# EAGLE board rt1060r2 (EAGLE 9.6.2)
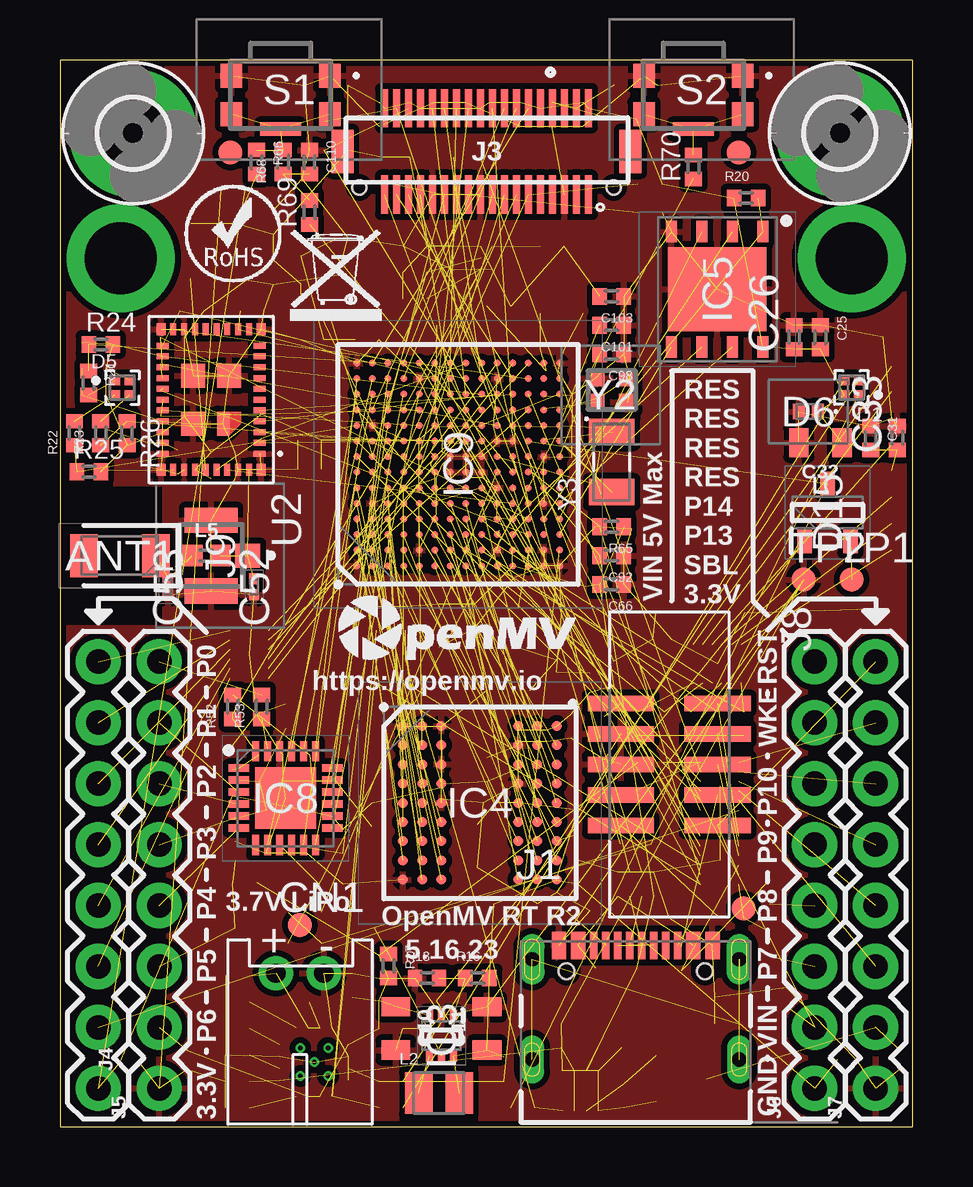
[diagram p15: board, top side]
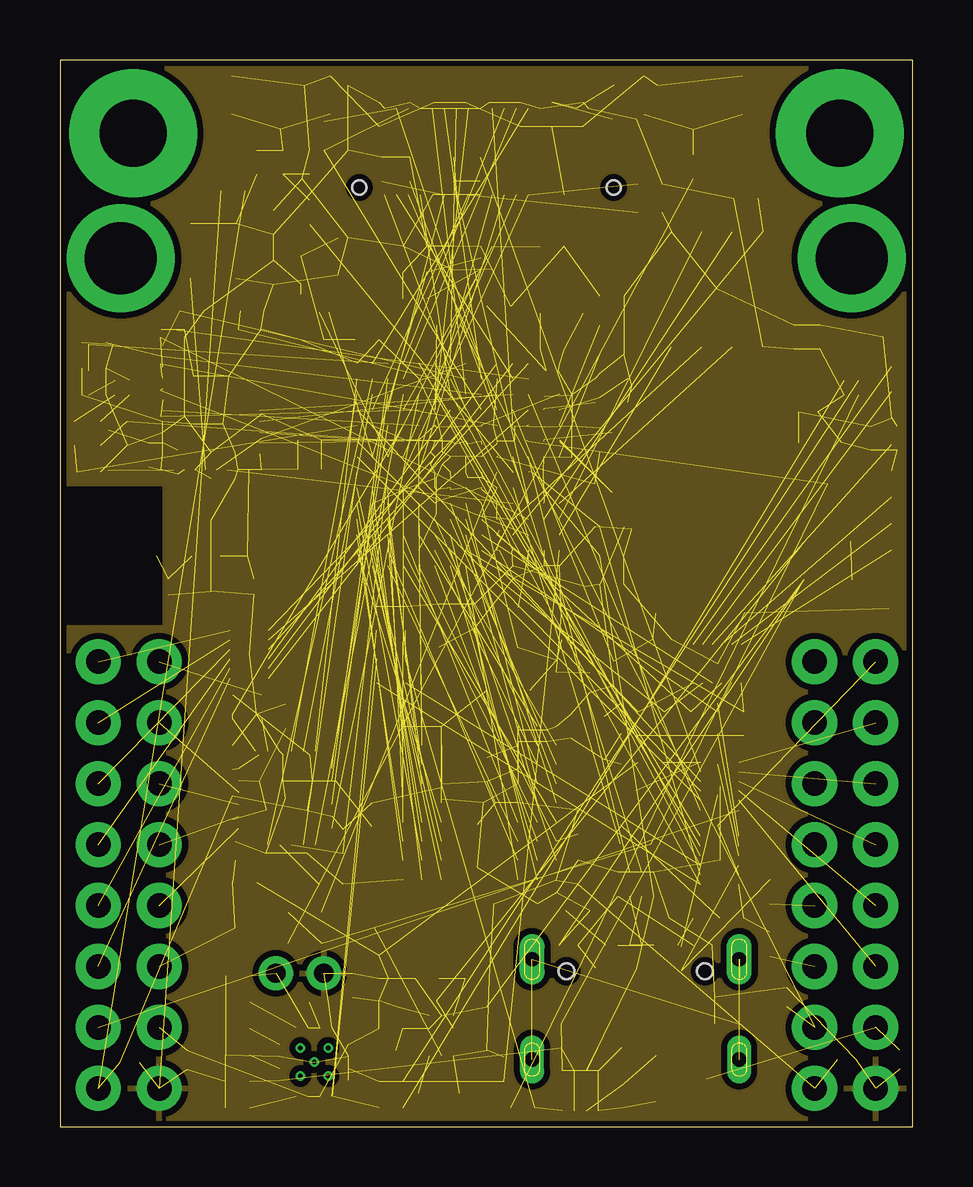
[diagram p16: board, inner layer GND]
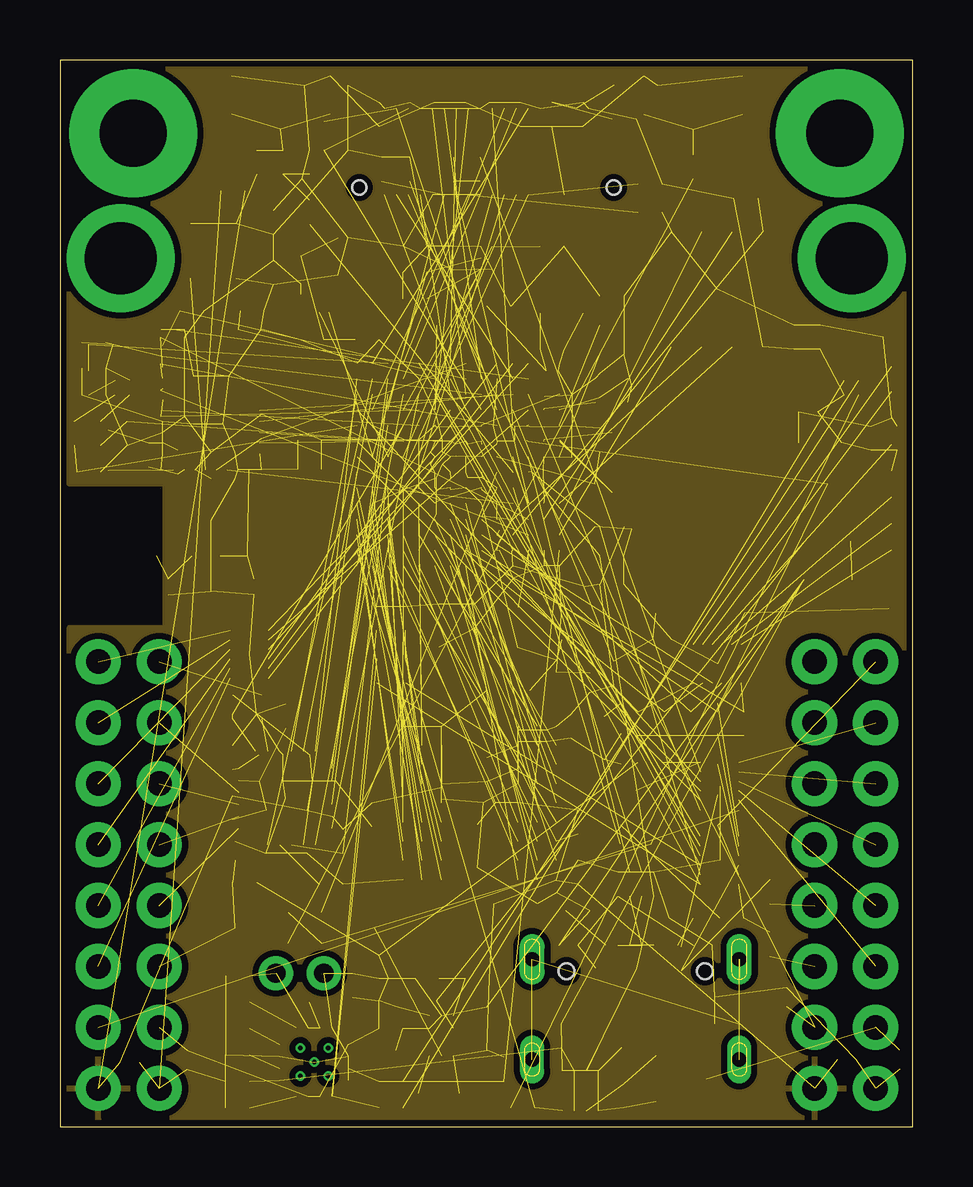
[diagram p17: board, inner layer VCC]
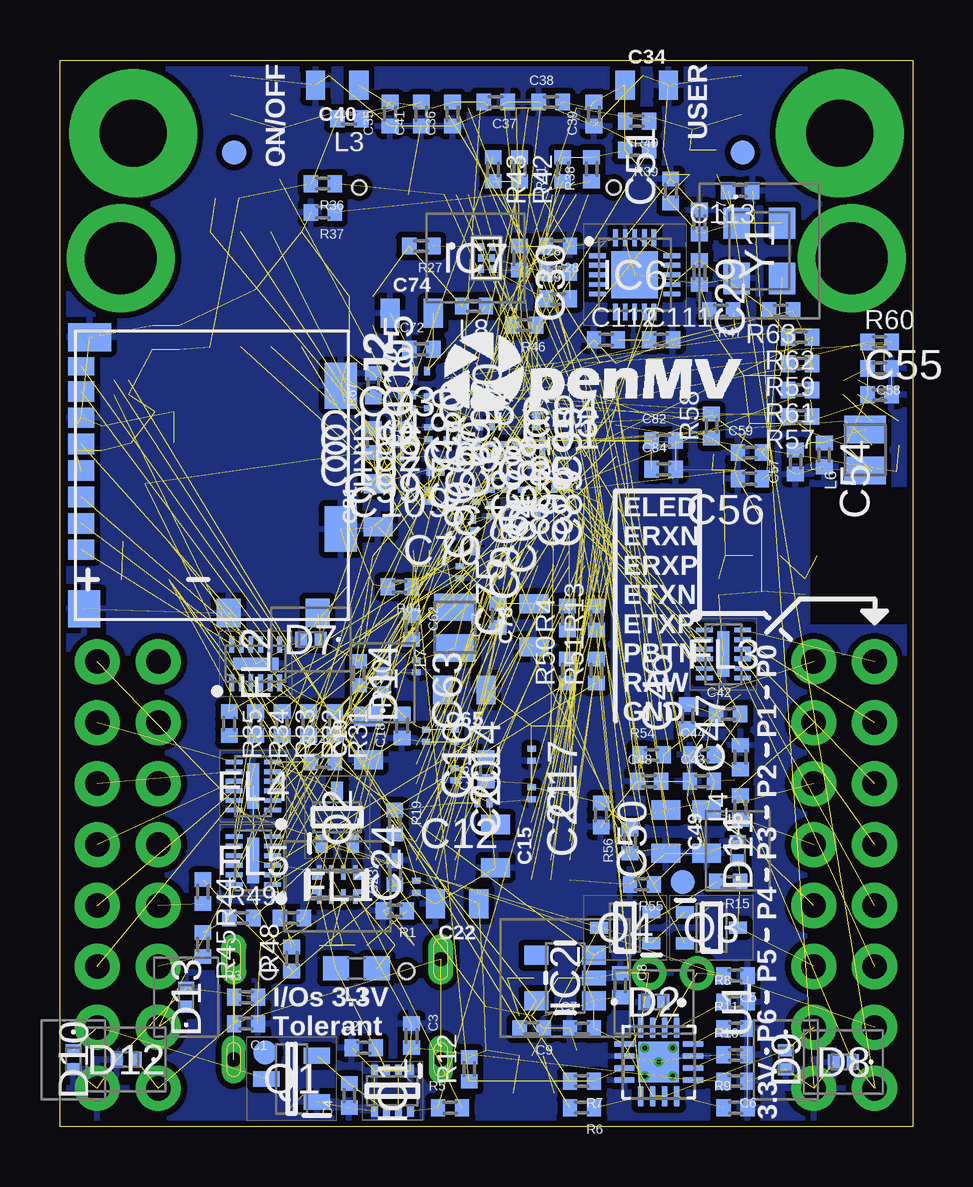
[diagram p18: board, bottom side, seen from below]

Size 35.56 x 44.45 mm. Coordinates in mm from the lower left corner, seen from the top.
Outline: 0,44.45 0,0 35.56,0 35.56,44.45 0,44.45
Copper layers (1*2*3*4*13*14*15*16): Top 0.035mm / dielectric 0.15mm / GND 0.035mm / dielectric 0.25mm / Route3 0.035mm / dielectric 0.15mm / Route4 0.035mm / dielectric 0.25mm / Route13 0.035mm / dielectric 0.15mm / Route14 0.035mm / dielectric 0.25mm / VCC 0.035mm / dielectric 0.15mm / Bottom 0.035mm
Design rules "MF_Ext_4_mil_drill_8_Layer *": minimum track width 3mil, minimum drill 4mil, track to track 3mil, track to pad 3mil, pad to pad 3mil, via to via 3mil, smd to smd 0mil, copper to edge 3mil, drill to drill 3mil, minimum pad ring 3mil, minimum via ring 3mil, stop-mask expansion 2mil, vias tented up to drill 25mil, thermal gap 10mil
Net classes: 0 default: width 0.102 mm, drill 0.127 mm, clearance 0.102 mm; 1 power: width 0.254 mm, drill 0.254 mm, clearance 0.102 mm; 2 gnd: width 0.102 mm, drill 0.127 mm, clearance 0.102 mm; 3 sdram: width 0.102 mm, drill 0.127 mm, clearance 0.102 mm; 4 jtag: width 0.102 mm, drill 0.127 mm, clearance 0.102 mm; 5 dcmi: width 0.102 mm, drill 0.127 mm, clearance 0.102 mm; 6 spi: width 0.102 mm, drill 0.127 mm, clearance 0.102 mm; 7 flash: width 0.102 mm, drill 0.127 mm, clearance 0.102 mm; 9 eth: width 0.102 mm, drill 0.127 mm, clearance 0.102 mm; 10 mdi: width 0.127 mm, drill 0.127 mm, clearance 0.102 mm; 11 wifi: width 0.102 mm, drill 0.127 mm, clearance 0.102 mm; 12 sdcard: width 0.102 mm, drill 0.127 mm, clearance 0.102 mm; 13 i2c: width 0.102 mm, drill 0.127 mm, clearance 0.102 mm; 14 mdio: width 0.102 mm, drill 0.127 mm, clearance 0.102 mm; 15 usb: width 0.102 mm, drill 0.127 mm, clearance 0.102 mm

## Footprints (pad centres in the part's own frame; a part is rotated, then mirrored left to right if it is on the bottom)
ANTC3216X140N = smd 1.15 x 1.8: 1 -1.5,0; 2 1.5,0
0402 = smd 0.6 x 0.7: 1 -0.5,0; 2 0.5,0
0805 = smd 0.8 x 1.2: 1 -0.9,0; 2 0.9,0
C0201 = smd 0.25 x 0.35: 1 -0.25,0; 2 0.25,0
CAPC0603X33N = smd 0.46 x 0.42: 1 -0.33,0; 2 0.33,0
JST-PH-2-THM-RA = drill 0.8 pad 1.422: 1 1,0; 2 -1,0
LED_UHD1110-FKA-CL1A13R3Q1BBQFMF3 = smd 0.4 x 0.4: 1 -0.3,0.3; 2 -0.3,-0.3; 3 0.3,-0.3; 4 0.3,0.3
CPDQT5V0HEHF = smd 0.5 x 0.65: 1 -0.4,0; 2 0.4,0
SOT96P237X111-3N = smd 1 x 0.6: 1 -1.2,0.955; 2 -1.2,-0.955; 3 1.2,0
FIDUCIAL-1X2 = smd 1 x 1: 1 0,0
ECMF024CMX8 = smd 0.2 x 0.6: 1 -0.75,-0.5; 2 -0.25,-0.5; 3 0.25,-0.5; 4 0.75,-0.5; 5 0.75,0.5; 6 0.25,0.5; 7 -0.25,0.5; 8 -0.75,0.5 | smd 0.2 x 0.2: 9 -0.95,0.3; 10 -0.95,-0.3; 11 0.95,-0.3; 12 0.95,0.3
SON40P150X250X65-13N = smd 0.7 x 0.2: 1 -0.8,1; 2 -0.8,0.6; 3 -0.8,0.2; 4 -0.8,-0.2; 5 -0.8,-0.6; 6 -0.8,-1; 7 0.8,-1; 8 0.8,-0.6; 9 0.8,-0.2; 10 0.8,0.2; 11 0.8,0.6; 12 0.8,1 | smd 0.5 x 1.9: 13 0,0
2,8-PAD = drill 2.8 pad 5.334: B2,8 0,0
SOTFL50P160X60-8N = smd 0.475 x 0.3: 1 -0.838,0.75; 2 -0.838,0.25; 3 -0.838,-0.25; 4 -0.838,-0.75; 5 0.838,-0.75; 6 0.838,-0.25; 7 0.838,0.25; 8 0.838,0.75
TCR2LF33LMCT = smd 0.8 x 1: 1 -0.95,-1.2; 3 0.95,-1.2; 4 0.95,1.2; 5 -0.95,1.2 | smd 0.6 x 1: 2 0,-1.2
SOTFL50P162X60-6N = smd 0.492 x 0.3: 1 -0.834,0.5; 2 -0.834,0; 3 -0.834,-0.5; 4 0.834,-0.5; 5 0.834,0; 6 0.834,0.5
BGA54C80P9X9_800X800X120 = smd 0.41 x 0.41: A1 -3.2,3.2; A2 -2.4,3.2; A3 -1.6,3.2; A7 1.6,3.2; A8 2.4,3.2; A9 3.2,3.2; B1 -3.2,2.4; B2 -2.4,2.4; B3 -1.6,2.4; B7 1.6,2.4; B8 2.4,2.4; B9 3.2,2.4; C1 -3.2,1.6; C2 -2.4,1.6; C3 -1.6,1.6; C7 1.6,1.6; C8 2.4,1.6; C9 3.2,1.6; D1 -3.2,0.8; D2 -2.4,0.8; D3 -1.6,0.8; D7 1.6,0.8; D8 2.4,0.8; D9 3.2,0.8; E1 -3.2,0; E2 -2.4,0; E3 -1.6,0; E7 1.6,0; E8 2.4,0; E9 3.2,0; F1 -3.2,-0.8; F2 -2.4,-0.8; F3 -1.6,-0.8; F7 1.6,-0.8; F8 2.4,-0.8; F9 3.2,-0.8; G1 -3.2,-1.6; G2 -2.4,-1.6; G3 -1.6,-1.6; G7 1.6,-1.6; G8 2.4,-1.6; G9 3.2,-1.6; H1 -3.2,-2.4; H2 -2.4,-2.4; H3 -1.6,-2.4; H7 1.6,-2.4; H8 2.4,-2.4; H9 3.2,-2.4; J1 -3.2,-3.2; J2 -2.4,-3.2; J3 -1.6,-3.2; J7 1.6,-3.2; J8 2.4,-3.2; J9 3.2,-3.2
SON127P500X595X80-9N = smd 0.9 x 0.45: 1 -2.4,1.905; 2 -2.4,0.635; 3 -2.4,-0.635; 4 -2.4,-1.905; 5 2.4,-1.905; 6 2.4,-0.635; 7 2.4,0.635; 8 2.4,1.905 | smd 3.5 x 4.1: 9 0,0
QFN40P300X300X33-21N = smd 0.7 x 0.2: 1 -1.55,0.8; 2 -1.55,0.4; 3 -1.55,0; 4 -1.55,-0.4; 5 -1.55,-0.8; 11 1.55,-0.8; 12 1.55,-0.4; 13 1.55,0; 14 1.55,0.4; 15 1.55,0.8 | smd 0.2 x 0.7: 6 -0.8,-1.55; 7 -0.4,-1.55; 8 0,-1.55; 9 0.4,-1.55; 10 0.8,-1.55; 16 0.8,1.55; 17 0.4,1.55; 18 0,1.55; 19 -0.4,1.55; 20 -0.8,1.55 | smd 1.95 x 1.95: 21 0,0
MXC4005XC = smd 0.25 x 0.3: 1 -0.22,0.46; 2 -0.22,0; 3 -0.22,-0.46; 4 0.22,-0.46; 5 0.22,0; 6 0.22,0.46
QFN50P400X400X90-25N = smd 0.85 x 0.3: 1 -1.95,1.25; 2 -1.95,0.75; 3 -1.95,0.25; 4 -1.95,-0.25; 5 -1.95,-0.75; 6 -1.95,-1.25; 13 1.95,-1.25; 14 1.95,-0.75; 15 1.95,-0.25; 16 1.95,0.25; 17 1.95,0.75; 18 1.95,1.25 | smd 0.3 x 0.85: 7 -1.25,-1.95; 8 -0.75,-1.95; 9 -0.25,-1.95; 10 0.25,-1.95; 11 0.75,-1.95; 12 1.25,-1.95; 19 1.25,1.95; 20 0.75,1.95; 21 0.25,1.95; 22 -0.25,1.95; 23 -0.75,1.95; 24 -1.25,1.95 | smd 2.55 x 2.55: 25 0,0
BGA196C65P14X14_1000X1000X143 = smd 0.29 x 0.29: A1 -4.225,4.225; A2 -3.575,4.225; A3 -2.925,4.225; A4 -2.275,4.225; A5 -1.625,4.225; A6 -0.975,4.225; A7 -0.325,4.225; A8 0.325,4.225; A9 0.975,4.225; A10 1.625,4.225; A11 2.275,4.225; A12 2.925,4.225; A13 3.575,4.225; A14 4.225,4.225; B1 -4.225,3.575; B2 -3.575,3.575; B3 -2.925,3.575; B4 -2.275,3.575; B5 -1.625,3.575; B6 -0.975,3.575; B7 -0.325,3.575; B8 0.325,3.575; B9 0.975,3.575; B10 1.625,3.575; B11 2.275,3.575; B12 2.925,3.575; B13 3.575,3.575; B14 4.225,3.575; C1 -4.225,2.925; C2 -3.575,2.925; C3 -2.925,2.925; C4 -2.275,2.925; C5 -1.625,2.925; C6 -0.975,2.925; C7 -0.325,2.925; C8 0.325,2.925; C9 0.975,2.925; C10 1.625,2.925; C11 2.275,2.925; C12 2.925,2.925; C13 3.575,2.925; C14 4.225,2.925; D1 -4.225,2.275; D2 -3.575,2.275; D3 -2.925,2.275; D4 -2.275,2.275; D5 -1.625,2.275; D6 -0.975,2.275; D7 -0.325,2.275; D8 0.325,2.275; D9 0.975,2.275; D10 1.625,2.275; D11 2.275,2.275; D12 2.925,2.275; D13 3.575,2.275; D14 4.225,2.275; E1 -4.225,1.625; E2 -3.575,1.625; E3 -2.925,1.625; E4 -2.275,1.625; E5 -1.625,1.625; E6 -0.975,1.625; E7 -0.325,1.625; E8 0.325,1.625; E9 0.975,1.625; E10 1.625,1.625; E11 2.275,1.625; E12 2.925,1.625; E13 3.575,1.625; E14 4.225,1.625; F1 -4.225,0.975; F2 -3.575,0.975; F3 -2.925,0.975; F4 -2.275,0.975; F5 -1.625,0.975; F6 -0.975,0.975; F7 -0.325,0.975; F8 0.325,0.975; F9 0.975,0.975; F10 1.625,0.975; F11 2.275,0.975; F12 2.925,0.975; F13 3.575,0.975; F14 4.225,0.975; G1 -4.225,0.325; G2 -3.575,0.325; G3 -2.925,0.325; G4 -2.275,0.325; G5 -1.625,0.325; G6 -0.975,0.325; G7 -0.325,0.325; G8 0.325,0.325; G9 0.975,0.325; G10 1.625,0.325; G11 2.275,0.325; G12 2.925,0.325; G13 3.575,0.325; G14 4.225,0.325; H1 -4.225,-0.325; H2 -3.575,-0.325; H3 -2.925,-0.325; H4 -2.275,-0.325; H5 -1.625,-0.325; H6 -0.975,-0.325; H7 -0.325,-0.325; H8 0.325,-0.325; H9 0.975,-0.325; H10 1.625,-0.325; H11 2.275,-0.325; H12 2.925,-0.325; H13 3.575,-0.325; H14 4.225,-0.325; J1 -4.225,-0.975; J2 -3.575,-0.975; J3 -2.925,-0.975; J4 -2.275,-0.975; J5 -1.625,-0.975; J6 -0.975,-0.975; J7 -0.325,-0.975; J8 0.325,-0.975; J9 0.975,-0.975; J10 1.625,-0.975; J11 2.275,-0.975; J12 2.925,-0.975; J13 3.575,-0.975; J14 4.225,-0.975; K1 -4.225,-1.625; K2 -3.575,-1.625; K3 -2.925,-1.625; K4 -2.275,-1.625; K5 -1.625,-1.625; K6 -0.975,-1.625; K7 -0.325,-1.625; K8 0.325,-1.625; K9 0.975,-1.625; K10 1.625,-1.625; K11 2.275,-1.625; K12 2.925,-1.625; K13 3.575,-1.625; K14 4.225,-1.625; L1 -4.225,-2.275; L2 -3.575,-2.275; L3 -2.925,-2.275; L4 -2.275,-2.275; L5 -1.625,-2.275; L6 -0.975,-2.275; L7 -0.325,-2.275; L8 0.325,-2.275; L9 0.975,-2.275; L10 1.625,-2.275; L11 2.275,-2.275; L12 2.925,-2.275; L13 3.575,-2.275; L14 4.225,-2.275; M1 -4.225,-2.925; M2 -3.575,-2.925; M3 -2.925,-2.925; M4 -2.275,-2.925; M5 -1.625,-2.925; M6 -0.975,-2.925; M7 -0.325,-2.925; M8 0.325,-2.925; M9 0.975,-2.925; M10 1.625,-2.925; M11 2.275,-2.925; M12 2.925,-2.925; M13 3.575,-2.925; M14 4.225,-2.925; N1 -4.225,-3.575; N2 -3.575,-3.575; N3 -2.925,-3.575; N4 -2.275,-3.575; N5 -1.625,-3.575; N6 -0.975,-3.575; N7 -0.325,-3.575; N8 0.325,-3.575; N9 0.975,-3.575; N10 1.625,-3.575; N11 2.275,-3.575; N12 2.925,-3.575; N13 3.575,-3.575; N14 4.225,-3.575; P1 -4.225,-4.225; P2 -3.575,-4.225; P3 -2.925,-4.225; P4 -2.275,-4.225; P5 -1.625,-4.225; P6 -0.975,-4.225; P7 -0.325,-4.225; P8 0.325,-4.225; P9 0.975,-4.225; P10 1.625,-4.225; P11 2.275,-4.225; P12 2.925,-4.225; P13 3.575,-4.225; P14 4.225,-4.225
GCT_USB4105-GF-A = smd 0.6 x 1.15: A1_B12 -3.2,4.755; A4_B9 -2.4,4.755; B1_A12 3.2,4.755; B4_A9 2.4,4.755 | smd 0.3 x 1.15: A5 -1.25,4.755; A6 -0.25,4.755; A7 0.25,4.755; A8 1.25,4.755; B5 1.75,4.755; B6 0.75,4.755; B7 -0.75,4.755; B8 -1.75,4.755 | drill 0.6 pad 1.05 long: S1 -4.32,4.18; S4 4.32,4.18 | drill 0.6 pad 1 long: S2 -4.32,0; S3 4.32,0 | hole 0.65: 2.89,3.68; -2.89,3.68
1040310811 = smd 1.2 x 1: CD$1 11.74,10.1; CD$2 11.74,6.4 | smd 1.55 x 1.35: G$1 11.565,0.375 | smd 1.17 x 1.8: G$2 0.245,0.6 | smd 1.9 x 1.35: G$3 2.27,11.075; G$4 8.24,11.075 | smd 0.85 x 1.1: P$1 9.105,0.25; P$2 8.005,0.25; P$3 6.905,0.25; P$4 5.805,0.25; P$5 4.705,0.25; P$6 3.605,0.25; P$7 2.505,0.25 | smd 0.75 x 1.1: P$8 1.455,0.25
DF12-36-DS = smd 0.3 x 1.6: 1 4.25,-1.8; 2 4.25,1.8; 3 3.75,-1.8; 4 3.75,1.8; 5 3.25,-1.8; 6 3.25,1.8; 7 2.75,-1.8; 8 2.75,1.8; 9 2.25,-1.8; 10 2.25,1.8; 11 1.75,-1.8; 12 1.75,1.8; 13 1.25,-1.8; 14 1.25,1.8; 15 0.75,-1.8; 16 0.75,1.8; 17 0.25,-1.8; 18 0.25,1.8; 19 -0.25,-1.8; 20 -0.25,1.8; 21 -0.75,-1.8; 22 -0.75,1.8; 23 -1.25,-1.8; 24 -1.25,1.8; 25 -1.75,-1.8; 26 -1.75,1.8; 27 -2.25,-1.8; 28 -2.25,1.8; 29 -2.75,-1.8; 30 -2.75,1.8; 31 -3.25,-1.8; 32 -3.25,1.8; 33 -3.75,-1.8; 34 -3.75,1.8; 35 -4.25,-1.8; 36 -4.25,1.8 | smd 0.9 x 1.8: F1 6,0; F2 -6,0 | hole 0.6: 5.3,-1.5; -5.3,-1.5
1X08 = drill 1.016 pad 1.88: 1 0,0; 2 2.54,0; 3 5.08,0; 4 7.62,0; 5 10.16,0; 6 12.7,0; 7 15.24,0; 8 17.78,0
CNC_3221-10-0300-00 = smd 0.65 x 2.76: 1 -2.54,-2.02; 2 -2.54,2.02; 3 -1.27,-2.02; 4 -1.27,2.02; 5 0,-2.02; 6 0,2.02; 7 1.27,-2.02; 8 1.27,2.02; 9 2.54,-2.02; 10 2.54,2.02
23370191 = smd 1 x 1.05: 1 0,-1.525 | smd 1.05 x 2.2: 2 -1.475,0; 3 1.475,0
0603 = smd 1.1 x 1: 1 -0.85,0; 2 0.85,0
INDC2016X100N = smd 1.14 x 1.73: 1 -0.847,0; 2 0.847,0
0402' = smd 0.85 x 0.9: 1 -0.58,0; 2 0.58,0
9774030151R = drill 3 pad 4.5: P$1 0,0
SOT96P240X110-3N = smd 1.1 x 0.65: 1 -1.05,0.96; 2 -1.05,-0.96; 3 1.05,0
SOT65P210X110-3N = smd 0.75 x 0.5: 1 -1.1,0.65; 2 -1.1,-0.65; 3 1.1,0
KMS231GLFS = smd 0.9 x 1: 1 -2.05,-0.8; 2 -2.05,0.8; 4 2.05,0.8; 5 2.05,-0.8 | smd 1.7 x 0.55: 3 0,1.425
TP10R = smd 1 x 1: TP 0,0
QFN50P300X300X100-17N = smd 0.86 x 0.26: 1 -1.435,0.75; 2 -1.435,0.25; 3 -1.435,-0.25; 4 -1.435,-0.75; 9 1.435,-0.75; 10 1.435,-0.25; 11 1.435,0.25; 12 1.435,0.75 | smd 0.26 x 0.86: 5 -0.75,-1.435; 6 -0.25,-1.435; 7 0.25,-1.435; 8 0.75,-1.435; 13 0.75,1.435; 14 0.25,1.435; 15 -0.25,1.435; 16 -0.75,1.435 | smd 1.68 x 1.68: 17 0,0 | drill 0.2 pad 0.4: 18 0,0; 19 -0.58,0.58; 20 0.58,0.58; 21 -0.58,-0.58; 22 0.58,-0.58
XCVR_LBEE5KL1DX-TEMP = smd 0.5 x 0.25: 1 -2.025,2.25; 2 -2.025,1.8; 3 -2.025,1.35; 4 -2.025,0.9; 5 -2.025,0.45; 6 -2.025,0; 7 -2.025,-0.45; 8 -2.025,-0.9; 9 -2.025,-1.35; 10 -2.025,-1.8; 11 -2.025,-2.25; 22 2.025,-2.25; 23 2.025,-1.8; 24 2.025,-1.35; 25 2.025,-0.9; 26 2.025,-0.45; 27 2.025,0; 28 2.025,0.45; 29 2.025,0.9; 30 2.025,1.35; 31 2.025,1.8; 32 2.025,2.25 | smd 0.375 x 0.5: 12 -2.087,-2.925; 21 2.087,-2.925; 33 2.087,2.925; 42 -2.087,2.925 | smd 0.25 x 0.5: 13 -1.575,-2.925; 14 -1.125,-2.925; 15 -0.675,-2.925; 16 -0.225,-2.925; 17 0.225,-2.925; 18 0.675,-2.925; 19 1.125,-2.925; 20 1.575,-2.925; 34 1.575,2.925; 35 1.125,2.925; 36 0.675,2.925; 37 0.225,2.925; 38 -0.225,2.925; 39 -0.675,2.925; 40 -1.125,2.925; 41 -1.575,2.925 | smd 0.5 x 1: 43 -0.5,1 | smd 1 x 1: 44 -0.75,-1; 45 0.75,1; 46 0.75,-1
ECS327MVATX3CNTR3 = smd 1.3 x 1.1: 1 -1.15,-0.95; 2 1.15,-0.95; 3 1.15,0.95; 4 -1.15,0.95
XRCGB24M000F3M00R0 = smd 0.75 x 0.7: 1 -0.675,-0.5; 2 0.675,-0.5; 3 0.675,0.5; 4 -0.675,0.5
XTAL_ABS07-32.768KHZ-7-T = smd 1.1 x 1.9: 1 -1.25,0; 2 1.25,0

## Placement (x,y rotation side)
ANT1  AMCA31-2R450G-S1F-T3  [ANTC3216X140N]  2.5,23.8 180 top
C1  1nF  [0402]  27.8,4.3 180 bottom
C2  4.7uF  [0402]  22.9,3.3 0 bottom
C3  4.7uF  [0402]  20.9,3.8 270 bottom
C4  4.7uF  [0402]  23.5,1.3 90 bottom
C5  4.7uF  [0402]  7.4,6.3 180 bottom
C6  4.7uF  [0402]  7.4,1.9 180 bottom
C7  4.7uF  [0402]  13.8,4.1 0 bottom
C8  4.7uF  [0402]  12.2,5.9 270 bottom
C9  4.7uF  [0402]  15.9,4.1 180 bottom
C10  22uF  [0805]  14,4.1 270 top
C11  22uF  [0805]  17.8,4.1 90 top
C12  0.22uF  [C0201]  17.9,13.5 180 bottom
C13  4.7uF  [0402]  17.8,14.9 90 bottom
C14  0.22uF  [C0201]  19.1,16.3 270 bottom
C15  22uF  [0805]  17.4,11.7 270 bottom
C16  0.22uF  [C0201]  20.3,16.3 270 bottom
C17  0.22uF  [C0201]  15.9,15.5 270 bottom
C18  4.7uF  [0402]  21.3,16.7 90 bottom
C19  22uF  [0805]  22.7,16.2 90 bottom
C20  0.22uF  [C0201]  19.1,14.7 270 bottom
C21  0.22uF  [C0201]  15.9,13.9 270 bottom
C22  22uF  [0805]  19,9.3 180 bottom
C23  4.7uF  [0402]  21.6,10.6 90 bottom
C24  0.22uF  [C0201]  20.7,10 90 bottom
C25  4.7uF  [0402]  31.7,32.9 270 top
C26  0.1uF  [0402]  30.6,32.9 90 top
C27  4.7uF  [0402]  8.9,37.7 270 bottom
C28  4.7uF  [0402]  14.8,36.7 180 bottom
C29  0.1uF  [0402]  8.9,35.6 270 bottom
C30  0.1uF  [0402]  16.4,36.2 270 bottom
C31  4.7uF  [0402]  33.8,28.7 270 top
C32  22uF  [0805]  31.7,28.5 180 top
C33  0.1uF  [0402]  34.9,28.7 90 top
C34  22uF  [0805]  11.1,43.4 0 bottom
C35  4.7uF  [0402]  21.8,42.2 90 bottom
C36  4.7uF  [0402]  19.2,42.2 90 bottom
C37  4.7uF  [0402]  17.4,42.7 180 bottom
C38  4.7uF  [0402]  15.1,42.7 0 bottom
C39  4.7uF  [0402]  13.3,42.2 90 bottom
C40  22uF  [0805]  24,43.4 180 bottom
C41  4.7uF  [0402]  20.5,42.2 90 bottom
C42  4.7uF  [0402]  7.7,17.2 0 bottom
C43  4.7uF  [0402]  8.8,14.4 0 bottom
C44  4.7uF  [0402]  8.8,15.5 0 bottom
C45  22uF  [0805]  8.6,12.3 270 bottom
C46  0.1uF  [0402]  9.4,17.1 90 bottom
C47  0.1uF  [0402]  7.2,15.4 90 bottom
C48  4.7uF  [0402]  11,14.4 0 bottom
C49  22uF  [0805]  10.3,12.3 270 bottom
C50  0.1uF  [0402]  13,13 270 bottom
C51  0.1uF  [0402]  10.1,39 90 bottom
C52  GRM0335C1H1R5BA01D  [CAPC0603X33N]  8.1,22.5 270 top
C53  DNP  [CAPC0603X33N]  4.5,22.5 270 top
C54  0.1uF  [0402]  3.7,28 270 bottom
C55  0.1uF  [0402]  1.4,30.5 0 bottom
C56  0.1uF  [0402]  6.8,27 180 bottom
C57  4.7uF  [0402]  4.9,27.7 90 bottom
C58  4.7uF  [0402]  1.4,31.6 180 bottom
C59  4.7uF  [0402]  6.8,28.1 0 bottom
C60  0.22uF  [C0201]  17,26.8 90 bottom
C61  0.22uF  [C0201]  17,28.2 270 bottom
C62  4.7uF  [0402]  20.9,20.8 270 bottom
C63  0.22uF  [C0201]  20.7,19.2 270 bottom
C64  0.22uF  [C0201]  17.6,25.7 270 bottom
C65  22uF  [0805]  18.7,18.2 180 bottom
C66  4.7uF  [0402]  23,22.6 180 top
C67  0.22uF  [C0201]  17.6,26.8 90 bottom
C68  0.22uF  [C0201]  17.6,28.2 270 bottom
C69  0.22uF  [C0201]  17.8,29.2 180 bottom
C70  0.22uF  [C0201]  18.6,25.3 180 bottom
C71  0.22uF  [C0201]  18.2,26.3 90 bottom
C72  4.7uF  [0402]  20.5,32.4 0 bottom
C73  0.22uF  [C0201]  20.5,31.5 180 bottom
C74  22uF  [0805]  20.9,33.9 0 bottom
C75  0.22uF  [C0201]  18.9,23.1 270 bottom
C76  0.22uF  [C0201]  18.6,24 0 bottom
C77  4.7uF  [0402]  17.3,21.3 90 bottom
C78  22uF  [0805]  15.8,20.9 90 bottom
C79  4.7uF  [0402]  22.5,28.6 270 bottom
C80  0.22uF  [C0201]  18.2,28.2 90 bottom
C81  22uF  [0805]  22.3,25.9 90 bottom
C82  4.7uF  [0402]  10.4,28.6 0 bottom
C83  0.22uF  [C0201]  14.7,26.6 180 bottom
C84  4.7uF  [0402]  10.4,27.4 0 bottom
C85  0.22uF  [C0201]  14.7,28.6 180 bottom
C86  0.22uF  [C0201]  19.2,28.6 0 bottom
C87  0.22uF  [C0201]  19.2,29.2 0 bottom
C88  0.22uF  [C0201]  15.7,25.8 90 bottom
C89  0.22uF  [C0201]  15.7,26.8 270 bottom
C90  0.22uF  [C0201]  20.2,26.3 270 bottom
C91  0.22uF  [C0201]  15.7,27.6 0 bottom
C92  4.7uF  [0402]  23,23.8 180 top
C93  0.22uF  [C0201]  15.7,28.1 0 bottom
C94  0.22uF  [C0201]  15.7,28.6 0 bottom
C95  0.22uF  [C0201]  15.7,29.4 270 bottom
C96  0.22uF  [C0201]  18.3,24.6 270 bottom
C97  0.22uF  [C0201]  16.3,26.8 270 bottom
C98  4.7uF  [0402]  23,32.2 180 top
C99  0.22uF  [C0201]  21.1,27.9 180 bottom
C100  0.22uF  [C0201]  16.5,28.2 90 bottom
C101  4.7uF  [0402]  23,33.4 180 top
C102  0.22uF  [C0201]  21.1,29.2 180 bottom
C103  4.7uF  [0402]  23,34.6 180 top
C104  0.22uF  [C0201]  21.1,30.5 180 bottom
C105  4.7pF  [C0201]  20.2,30.2 90 bottom
C106  4.7pF  [C0201]  21.1,29.9 180 bottom
C107  18pF  [C0201]  21.1,28.6 180 bottom
C108  18pF  [C0201]  20.2,28.9 90 bottom
C109  0.22uF  [C0201]  19.9,27.3 180 bottom
C110  4.7uF  [0402]  10.4,40.2 270 top
C111  0.1uF  [0402]  10.5,32.8 0 bottom
C112  4.7uF  [0402]  12.8,32.8 0 bottom
C113  4.7uF  [0402]  7.2,39 180 bottom
CN1  S2B-PH-K-S(LF)(SN)  [JST-PH-2-THM-RA]  10,6.4 180 top
D1  UHD1110-FKA-CL1A13R3Q1BBQFMF3  [LED_UHD1110-FKA-CL1A13R3Q1BBQFMF3]  33,30.8 180 top
D2  CPDQT5V0HE-HF  [CPDQT5V0HEHF]  10.8,5.2 180 bottom
D5  UHD1110-FKA-CL1A13R3Q1BBQFMF3  [LED_UHD1110-FKA-CL1A13R3Q1BBQFMF3]  2.6,30.8 0 top
D6  CPDQT5V0HE-HF  [CPDQT5V0HEHF]  31.2,29.8 180 top
D7  CPDQT5V0HE-HF  [CPDQT5V0HEHF]  25.1,20.3 180 bottom
D8  CPDQT5V0HE-HF  [CPDQT5V0HEHF]  2.9,2.7 180 bottom
D9  CPDQT5V0HE-HF  [CPDQT5V0HEHF]  5.3,2.8 270 bottom
D10  CPDQT5V0HE-HF  [CPDQT5V0HEHF]  35,2.8 270 bottom
D11  CPDQT5V0HE-HF  [CPDQT5V0HEHF]  7.3,11.5 90 bottom
D12  CPDQT5V0HE-HF  [CPDQT5V0HEHF]  32.8,2.8 180 bottom
D13  CPDQT5V0HE-HF  [CPDQT5V0HEHF]  30.3,5.4 90 bottom
D14  CPDQT5V0HE-HF  [CPDQT5V0HEHF]  22.1,18.5 90 bottom
D15  BAT54CLT3G  [SOT96P237X111-3N]  32,25.6 90 top
FD1  FIDUCIAL1X2  [FIDUCIAL-1X2]  10,8.4 0 top
FD2  FIDUCIAL1X2  [FIDUCIAL-1X2]  28.5,9.1 0 top
FD3  FIDUCIAL1X2  [FIDUCIAL-1X2]  7.1,40.6 0 bottom
FD4  FIDUCIAL1X2  [FIDUCIAL-1X2]  27,3.1 0 bottom
FD5  FIDUCIAL1X2  [FIDUCIAL-1X2]  28.3,40.6 0 top
FD6  FIDUCIAL1X2  [FIDUCIAL-1X2]  7.1,40.6 0 top
FD7  FIDUCIAL1X2  [FIDUCIAL-1X2]  28.3,40.6 0 bottom
FD8  FIDUCIAL1X2  [FIDUCIAL-1X2]  9.6,10.2 0 bottom
FL1  ECMF02-4CMX8  [ECMF024CMX8]  24,10.1 0 bottom
FL2  EMIF06-1005M12  [SON40P150X250X65-13N]  27.4,19.3 90 bottom
FL3  EMIF06-1005M12  [SON40P150X250X65-13N]  7.9,19.7 0 bottom
FL4  EMIF06-1005M12  [SON40P150X250X65-13N]  27.5,14.2 180 bottom
FL5  EMIF06-1005M12  [SON40P150X250X65-13N]  27.5,11.1 180 bottom
H1  MOUNT-PAD-ROUND2.8  [2,8-PAD]  3.05,41.4 90 top
H2  MOUNT-PAD-ROUND2.8  [2,8-PAD]  32.51,41.4 270 top
IC1  LM66200DRLR  [SOTFL50P160X60-8N]  21.7,1.5 270 bottom
IC2  TCR2LF33,LM_CT  [TCR2LF33LMCT]  14.5,6.2 90 bottom
IC3  AP61300Z6-7  [SOTFL50P162X60-6N]  15.9,3.8 270 top
IC4  IS42S16160G-6BL  [BGA54C80P9X9_800X800X120]  17.5,13.5 0 top
IC5  IS25LP128F-JKLE-TR  [SON127P500X595X80-9N]  27.4,34.9 270 top
IC6  SE050C1HQ1_Z01SCZ  [QFN40P300X300X33-21N]  11.6,35.5 0 bottom
IC7  MXC4005XC  [MXC4005XC]  17.78,36.2 0 bottom
IC8  KSZ8081RNDCA-TR  [QFN50P400X400X90-25N]  9.4,13.7 0 top
IC9  MIMXRT106FDVL6B  [BGA196C65P14X14_1000X1000X143]  16.6,27.6 90 top
J1  USB4105-GF-A  [GCT_USB4105-GF-A]  24,2.8 0 top
J2  USD-1040310811  [1040310811]  34.92,33.15 270 bottom
J3  DF12-36-DS  [DF12-36-DS]  17.78,40.64 0 top
J4  DNP  [1X08]  1.6,1.6 90 top
J5  DNP  [1X08]  4.14,1.6 90 top
J6  DNP  [1X08]  31.46,1.6 90 top
J7  DNP  [1X08]  34,1.6 90 top
J8  3221-10-0300-00  [CNC_3221-10-0300-00]  25.4,15.1 270 top
J9  DNP  [23370191]  6.3,23.8 90 top
L1  100  [0603]  23.2,6.6 180 bottom
L2  MAKK2016T1R0M  [INDC2016X100N]  15.8,1.4 0 top
L3  100  [0402]  23.5,42 180 bottom
L4  100  [0402]  7.2,13.3 90 bottom
L5  3.9NH  [0402']  6.1,23.8 0 top
L6  MAKK2016T2R2M  [INDC2016X100N]  2,28.2 90 bottom
L7  MAKK2016T4R7M  [INDC2016X100N]  19.1,20.8 90 bottom
L8  100  [0402]  18.3,34.2 180 bottom
M1  9774030151R  [9774030151R]  33.02,36.2 0 top
M2  9774030151R  [9774030151R]  2.54,36.2 0 top
Q1  DMG2301L-7  [SOT96P240X110-3N]  25.9,2 180 bottom
Q2  2N7002KW_R1_00001  [SOT65P210X110-3N]  24,12.9 90 bottom
Q3  2N7002KW_R1_00001  [SOT65P210X110-3N]  8.4,8.3 0 bottom
Q4  2N7002KW_R1_00001  [SOT65P210X110-3N]  12,8.3 180 bottom
R1  5.1K  [0402]  21.6,9 180 bottom
R2  5.1K  [0402]  25.9,8.7 0 bottom
R3  1M  [0402]  27.8,5.4 0 bottom
R4  100K  [0402]  14.4,21.2 90 bottom
R5  1K  [0402]  19.3,0.8 0 bottom
R6  5.1K  [0402]  13.8,0.8 180 bottom
R7  10K  [0402]  13.8,1.9 180 bottom
R8  10K  [0402]  7.4,5.2 0 bottom
R9  1.1K  [0402]  7.4,0.8 0 bottom
R10  46.4K  [0402]  7.4,3 0 bottom
R11  8.2K  [0402]  7.4,4.1 0 bottom
R12  100K  [0402]  18.5,2.4 90 bottom
R13  100K  [0402]  13.2,21.2 90 bottom
R14  100K  [0402]  24.6,15.2 0 bottom
R15  100K  [0402]  7.7,10.2 180 bottom
R16  200K  [0402]  17.4,6.2 0 top
R17  100K  [0402]  13.7,6.7 270 top
R18  44.2K  [0402]  15.3,6.2 0 top
R19  100K  [0402]  21.6,12.7 270 bottom
R20  100K  [0402]  28.6,38.7 0 top
R21  1K  [0402]  1.2,31 270 top
R22  10K  [0402]  0.6,28.9 90 top
R23  5.1K  [0402]  1.7,28.9 90 top
R24  10K  [0402]  1.7,32.6 0 top
R25  10K  [0402]  1.2,27.3 0 top
R26  10K  [0402]  2.8,28.9 270 top
R27  2.7K  [0402]  20.5,36.7 180 bottom
R28  2.7K  [0402]  14.8,35.6 0 bottom
R29  2.7K  [0402]  14.8,34.5 0 bottom
R30  100K  [0402]  23.1,18.9 270 bottom
R31  100K  [0402]  24.1,16.8 270 bottom
R32  100K  [0402]  25.2,16.8 270 bottom
R33  100K  [0402]  26.3,16.8 270 bottom
R34  100K  [0402]  27.4,16.8 270 bottom
R35  100K  [0402]  28.5,16.8 270 bottom
R36  100K  [0402]  24.6,39.3 180 bottom
R37  10K  [0402]  24.6,38.1 180 bottom
R38  10K  [0402]  13.4,39.9 90 bottom
R39  4.7K  [0402]  11.5,40.7 180 bottom
R40  4.7K  [0402]  11.5,41.9 180 bottom
R41  100K  [0402]  14.6,39.9 90 bottom
R42  1K  [0402]  16.4,39.9 270 bottom
R43  1K  [0402]  17.5,39.9 270 bottom
R44  0  [0402]  29.6,9.8 270 bottom
R45  0  [0402]  29.6,7.6 270 bottom
R46  10K  [0402]  16.2,33.4 180 bottom
R47  10K  [0402]  8,34 180 bottom
R48  DNP  [0402]  25.9,7 90 bottom
R49  DNP  [0402]  28,8.7 0 bottom
R50  DNP  [0402]  14.4,19 90 bottom
R51  DNP  [0402]  13.2,19 90 bottom
R52  100K  [0402]  7.2,17.5 90 top
R53  220  [0402]  8.4,17.5 90 top
R54  1K  [0402]  10.9,15.5 0 bottom
R55  6.49K  [0402]  11.3,10.1 180 bottom
R56  1K  [0402]  11.8,11.9 90 bottom
R57  10K  [0402]  4.7,29.6 180 bottom
R58  10K  [0402]  8.4,29.2 90 bottom
R59  100K  [0402]  4.7,31.8 180 bottom
R60  100K  [0402]  1.4,32.7 0 bottom
R61  100K  [0402]  4.7,30.7 180 bottom
R62  100K  [0402]  4.7,32.9 180 bottom
R63  100K  [0402]  5.5,34 180 bottom
R64  30K  [0402]  21.4,22.5 180 bottom
R65  100K  [0402]  23,25 180 top
R66  10K  [0402]  8.2,40.2 270 top
R67  2.2M  [0402]  22.5,30.9 90 bottom
R68  10K  [0402]  9.3,40.2 90 top
R69  100K  [0402]  10.4,38.1 90 top
R70  10K  [0402]  26.4,40 90 top
S1  KMS231GLFS  [KMS231GLFS]  9.2,43 180 top
S2  KMS231GLFS  [KMS231GLFS]  26.4,43 180 top
TP1  TPTP10R  [TP10R]  33,22.8 0 top
TP2  TPTP10R  [TP10R]  31,22.8 0 top
U1  BQ24075RGTR  [QFN50P300X300X100-17N]  10.6,2.7 270 bottom
U2  LBEE5KL1DX-883  [XCVR_LBEE5KL1DX-TEMP]  6.3,30.3 180 top
U$1  [WEEE]  9.6,33.6 0 top
U$2  [ROHS]  5.2,35.2 0 top
U$3  [OMV-LOGO]  19.68,29.59 0 bottom
U$4  [OMV-LOGO-SMALL]  11.5,19.3 0 top
Y1  ECS-327MVATX-3-CN-TR3  [ECS327MVATX3CNTR3]  6.4,36.5 270 bottom
Y2  XRCGB24M000F3M00R0  [XRCGB24M000F3M00R0]  23,30.7 0 top
Y3  SC32S-7PF20PPM  [XTAL_ABS07-32.768KHZ-7-T]  23,27.7 90 top

## Tracks (layer width: path | path; a pad name or v marks a point on that pad's centre or on a via)
ANT  (3 unrouted)
BAT  (4 unrouted)
BT_D_WAKE  (1 unrouted)
BT_H_WAKE  (2 unrouted)
BT_REG_ON  (2 unrouted)
BT_UART_CTS  (1 unrouted)
BT_UART_RTS  (1 unrouted)
BT_UART_RX  (1 unrouted)
BT_UART_TX  (1 unrouted)
C_VOUT  (3 unrouted)
CC1  (1 unrouted)
CC2  (1 unrouted)
CHG  (3 unrouted)
D_N  (2 unrouted)
D_P  (2 unrouted)
DCDC_LP  (2 unrouted)
DCDC_PSWITCH  (2 unrouted)
DCMI_CLK  (1 unrouted)
DCMI_D0  (1 unrouted)
DCMI_D1  (1 unrouted)
DCMI_D2  (1 unrouted)
DCMI_D3  (1 unrouted)
DCMI_D4  (1 unrouted)
DCMI_D5  (1 unrouted)
DCMI_D6  (1 unrouted)
DCMI_D7  (2 unrouted)
DCMI_FSIN  (1 unrouted)
DCMI_HSYNC  (1 unrouted)
DCMI_MISO  (1 unrouted)
DCMI_MOSI  (1 unrouted)
DCMI_PCLK  (1 unrouted)
DCMI_PWDN  (2 unrouted)
DCMI_RST  (2 unrouted)
DCMI_SCL  (2 unrouted)
DCMI_SCLK  (1 unrouted)
DCMI_SDA  (2 unrouted)
DCMI_SSEL  (2 unrouted)
DCMI_VSYNC  (1 unrouted)
EN  (2 unrouted)
ETH_INT  (2 unrouted)
ETH_LED  (1 unrouted)
ETH_MDC  (1 unrouted)
ETH_MDIO  (2 unrouted)
ETH_RST  (3 unrouted)
ETH_RXD0  (1 unrouted)
ETH_RXD1  (1 unrouted)
ETH_RXDV  (1 unrouted)
ETH_RXERR  (1 unrouted)
ETH_TXCLK  (1 unrouted)
ETH_TXD0  (1 unrouted)
ETH_TXD1  (1 unrouted)
ETH_TXEN  (1 unrouted)
ETH_VDD_1.2  (2 unrouted)
ETH_VDDA_3.3  (4 unrouted)
FB  (2 unrouted)
FEED  (2 unrouted)
GND  (228 unrouted)
  pour GND (isolate 0.254): 0,0 0,20.8 4.4,20.8 4.4,26.8 0,26.8 0,44.45 35.56,44.45 35.56,0
  pour Top (isolate 0.254): 0.1,0.1 0.1,20.8 4.4,20.8 4.4,26.8 0.1,26.8 0.1,44.35 35.46,44.35 35.46,0.1
  pour Bottom (isolate 0.254): 0.2,0.2 0.2,20.8 4.4,20.8 4.4,26.8 0.2,26.8 0.2,44.25 35.36,44.25 35.36,0.2
ILIM  (1 unrouted)
INT_I2C_INT  (2 unrouted)
INT_I2C_SCL  (3 unrouted)
INT_I2C_SDA  (3 unrouted)
ISET  (1 unrouted)
JTAG_TCK  (1 unrouted)
JTAG_TCK_INT  (1 unrouted)
JTAG_TDI  (2 unrouted)
JTAG_TDI_INT  (2 unrouted)
JTAG_TDI_INT_UNUSED  (1 unrouted)
JTAG_TDO  (1 unrouted)
JTAG_TDO_INT  (1 unrouted)
JTAG_TMS  (1 unrouted)
JTAG_TMS_INT  (1 unrouted)
JTAG_TRSTB  (2 unrouted)
JTAG_TRSTB_INT  (2 unrouted)
JTAG_TRSTB_INT_UNUSED  (1 unrouted)
LED_B  (2 unrouted)
LED_B_INT  (1 unrouted)
LED_CHG  (1 unrouted)
LED_G  (2 unrouted)
LED_G_INT  (1 unrouted)
LED_PGOOD  (1 unrouted)
LED_R  (2 unrouted)
LED_R_INT  (1 unrouted)
LED_ST  (1 unrouted)
LPO_IN  (1 unrouted)
MDI_LED  (1 unrouted)
MDI_RX_N  (1 unrouted)
MDI_RX_P  (1 unrouted)
MDI_TX_N  (1 unrouted)
MDI_TX_P  (1 unrouted)
NVCC_PLL  (2 unrouted)
ONOFF  (2 unrouted)
ONOFF_BUTTON  (3 unrouted)
P0_MOSI  (1 unrouted)
P0_MOSI_INT  (1 unrouted)
P1_MISO  (1 unrouted)
P1_MISO_INT  (1 unrouted)
P2_SCLK  (1 unrouted)
P2_SCLK_INT  (1 unrouted)
P3_NSS  (1 unrouted)
P3_NSS_INT  (1 unrouted)
P4_SCL  (1 unrouted)
P4_SCL_INT  (1 unrouted)
P5_SDA  (1 unrouted)
P5_SDA_INT  (1 unrouted)
P6_ADC  (1 unrouted)
P6_ADC_INT  (1 unrouted)
P7_PWM  (1 unrouted)
P7_PWM_INT  (1 unrouted)
P8_PWM  (1 unrouted)
P8_PWM_INT  (1 unrouted)
P9_PWM  (1 unrouted)
P9_PWM_INT  (1 unrouted)
P10_PWM  (1 unrouted)
P10_PWM_INT  (1 unrouted)
P11_WAKEUP  (2 unrouted)
P11_WAKEUP_INT  (1 unrouted)
P12_RST_N  (3 unrouted)
P12_RST_N_EXT  (2 unrouted)
P13  (1 unrouted)
P14  (1 unrouted)
P_FLASH_CE  (2 unrouted)
P_FLASH_IO0  (1 unrouted)
P_FLASH_IO1  (1 unrouted)
P_FLASH_IO2  (1 unrouted)
P_FLASH_IO3  (1 unrouted)
P_FLASH_SCK  (1 unrouted)
PGOOD  (3 unrouted)
PMIC_ON_REQ  (1 unrouted)
PMIC_ONOFF  (3 unrouted)
PMIC_STBY_REQ  (1 unrouted)
PWM_FSIN  (3 unrouted)
RAW  (13 unrouted)
REXT  (1 unrouted)
RTC_XTALI  (2 unrouted)
RTC_XTALO  (2 unrouted)
SBL  (2 unrouted)
SD_CD  (3 unrouted)
SD_CLK  (1 unrouted)
SD_CLK_INT  (1 unrouted)
SD_CMD  (2 unrouted)
SD_CMD_INT  (1 unrouted)
SD_DAT0  (2 unrouted)
SD_DAT0_INT  (1 unrouted)
SD_DAT1  (2 unrouted)
SD_DAT1_INT  (1 unrouted)
SD_DAT2  (2 unrouted)
SD_DAT2_INT  (1 unrouted)
SD_DAT3  (2 unrouted)
SD_DAT3_INT  (1 unrouted)
SDRAM_A0  (1 unrouted)
SDRAM_A1  (1 unrouted)
SDRAM_A2  (1 unrouted)
SDRAM_A3  (1 unrouted)
SDRAM_A4  (1 unrouted)
SDRAM_A5  (1 unrouted)
SDRAM_A6  (1 unrouted)
SDRAM_A7  (1 unrouted)
SDRAM_A8  (1 unrouted)
SDRAM_A9  (1 unrouted)
SDRAM_A10  (1 unrouted)
SDRAM_A11  (1 unrouted)
SDRAM_A12  (1 unrouted)
SDRAM_BA0  (1 unrouted)
SDRAM_BA1  (1 unrouted)
SDRAM_CAS  (1 unrouted)
SDRAM_CKE  (1 unrouted)
SDRAM_CLK  (1 unrouted)
SDRAM_CS  (2 unrouted)
SDRAM_DQ0  (1 unrouted)
SDRAM_DQ1  (1 unrouted)
SDRAM_DQ2  (1 unrouted)
SDRAM_DQ3  (1 unrouted)
SDRAM_DQ4  (1 unrouted)
SDRAM_DQ5  (1 unrouted)
SDRAM_DQ6  (1 unrouted)
SDRAM_DQ7  (1 unrouted)
SDRAM_DQ8  (1 unrouted)
SDRAM_DQ9  (1 unrouted)
SDRAM_DQ10  (1 unrouted)
SDRAM_DQ11  (1 unrouted)
SDRAM_DQ12  (1 unrouted)
SDRAM_DQ13  (1 unrouted)
SDRAM_DQ14  (1 unrouted)
SDRAM_DQ15  (1 unrouted)
SDRAM_DQMH  (1 unrouted)
SDRAM_DQML  (1 unrouted)
SDRAM_RAS  (1 unrouted)
SDRAM_WE  (1 unrouted)
SHELL_GND  (5 unrouted)
SNVS_BAT  (1 unrouted)
SR_VLX  (1 unrouted)
ST  (3 unrouted)
SW  (1 unrouted)
SWITCH  (4 unrouted)
SWITCH_OUT  (2 unrouted)
TMR  (1 unrouted)
TS  (1 unrouted)
USB_D_N  (1 unrouted)
USB_D_P  (1 unrouted)
USB_VBUS  (3 unrouted)
V_BATT  (4 unrouted)
VBUS  (6 unrouted)
VCC  (137 unrouted)
  pour VCC (isolate 0.254): 0.41,0.4 0.41,20.8 4.4,20.8 4.4,26.8 0.4,26.8 0.38,26.82 0.38,44.07 35.18,44.07 35.18,0.4
VCC_SOC  (23 unrouted)
VDD_HIGH_CAP  (2 unrouted)
VDD_SNVS  (2 unrouted)
VDD_SNVS_CAP  (1 unrouted)
VDD_SNVS_CPU  (5 unrouted)
VDD_USB_CAP  (3 unrouted)
VDDA  (3 unrouted)
VDDA_ADC_3P3  (4 unrouted)
VIN  (2 unrouted)
VIN_INT  (2 unrouted)
VIN_LDO  (3 unrouted)
WAKEUP  (1 unrouted)
WIFI_CLK  (1 unrouted)
WIFI_CMD  (2 unrouted)
WIFI_D0  (2 unrouted)
WIFI_D1  (2 unrouted)
WIFI_D2  (2 unrouted)
WIFI_D3  (2 unrouted)
WL_H_WAKE  (2 unrouted)
WL_REG_ON  (1 unrouted)
XTALI  (3 unrouted)
XTALO  (2 unrouted)

## Text on the board
tPlace: VIN 5V Max | RES / RES / RES / RES / P14 / P13 / SBL / 3.3V | P0 | https://openmv.io | RST | P1 | WKE | P2 | P10 | P3 | P9 | P4 | 3.7V LiPo | P8 | OpenMV RT R2 | 5.16.23 | P5 | P7 | P6 | VIN | 3.3V | GND
bPlace: USER | ON/OFF | P0 | ELED / ERXN / ERXP / ETXN / ETXP / PBTN / RAW / GND | P1 | P2 | P3 | P4 | P5 | P6 | I/Os 3.3V / Tolerant | 3.3V